# EAGLE board Dx32_V1.1 (EAGLE 9.6.2)
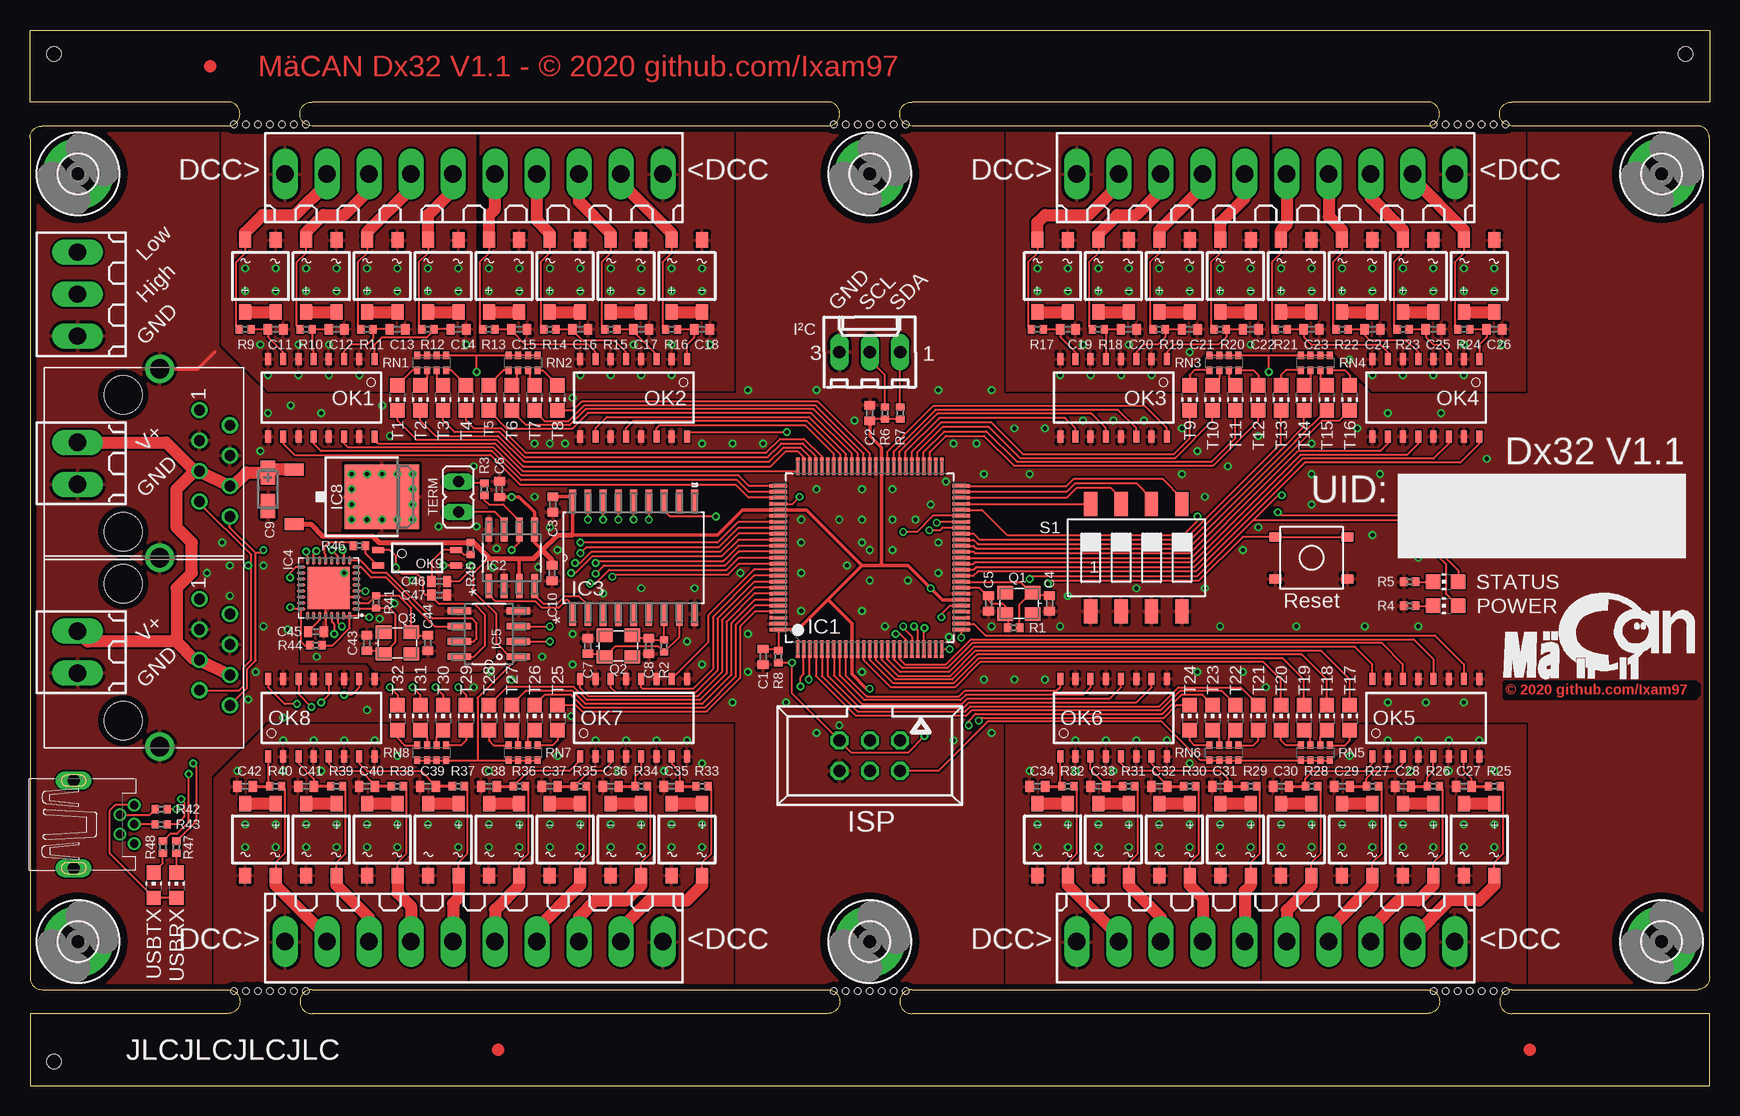
[diagram p2: board, top side]
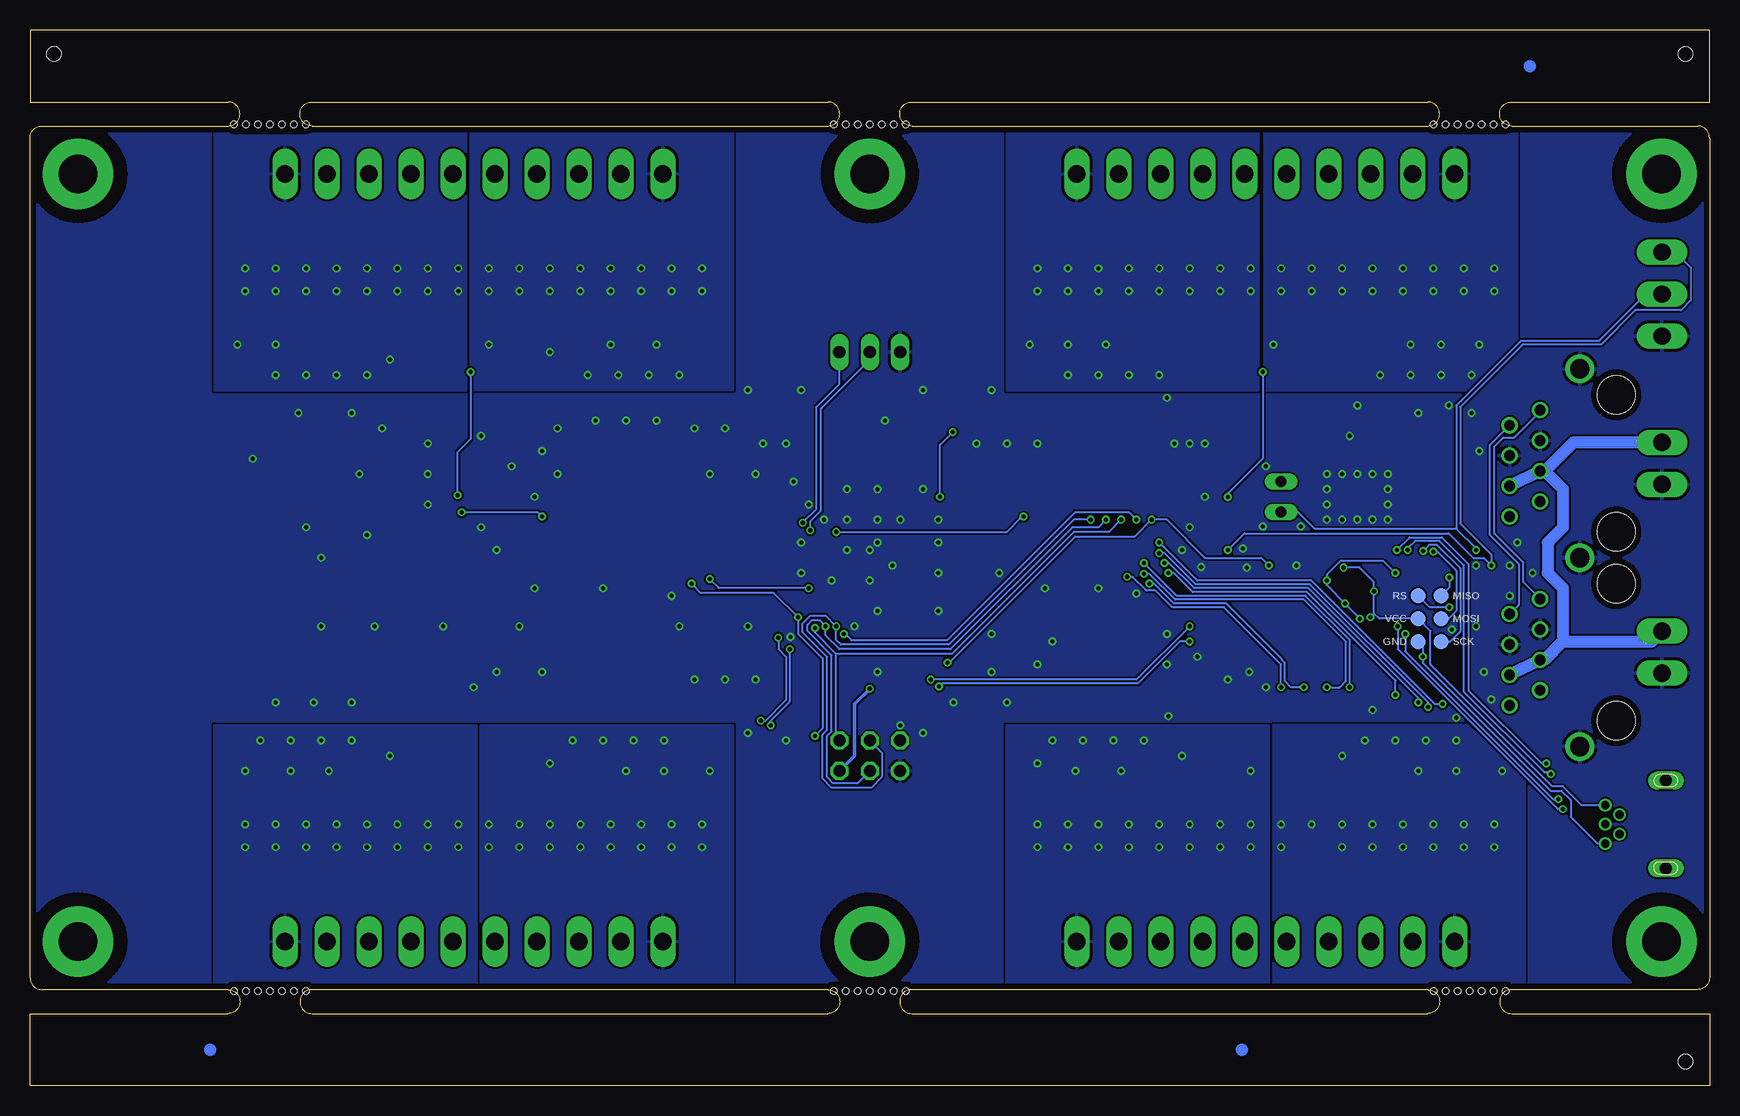
[diagram p3: board, bottom side, seen from below]

Size 140 x 88 mm. Coordinates in mm from the lower left corner, seen from the top.
Outline: 1,8 16.5,8 arc-90 17.5,7 arc-90 16.5,6 0,6 0,0 140,0 140,6 123.5,6 arc-90 122.5,7 arc-90 123.5,8 139,8 arc90 140,9 140,79 arc90 139,80 123.5,80 arc-90 122.5,81 arc-90 123.5,82 140,82 140,88 0,88 0,82 16.5,82 arc-90 17.5,81 arc-90 16.5,80 1,80 arc90 0,79 0,9 arc90 1,8
Outline: 23.5,8 66.5,8 arc-90 67.5,7 arc-90 66.5,6 23.5,6 arc-90 22.5,7 arc-90 23.5,8
Outline: 73.5,8 116.5,8 arc-90 117.5,7 arc-90 116.5,6 73.5,6 arc-90 72.5,7 arc-90 73.5,8
Outline: 116.5,80 73.5,80 arc-90 72.5,81 arc-90 73.5,82 116.5,82 arc-90 117.5,81 arc-90 116.5,80
Outline: 66.5,80 23.5,80 arc-90 22.5,81 arc-90 23.5,82 66.5,82 arc-90 67.5,81 arc-90 66.5,80
Copper layers (1*16): Top 0.035mm / dielectric 1.6mm / Bottom 0.035mm
Design rules "Elecrow_2-layer_PCB_eagle_rule": minimum track width 6mil, minimum drill 12mil, track to track 6mil, track to pad 6mil, pad to pad 6mil, via to via 8mil, smd to smd 0mil, copper to edge 20mil, drill to drill 10mil, minimum pad ring 6mil, minimum via ring 6mil, stop-mask expansion 0mil, vias tented up to drill 100mil, thermal gap 10mil

## Footprints (pad centres in the part's own frame; a part is rotated, then mirrored left to right if it is on the bottom)
MBS = smd 1 x 1.3: + -1.27,-3; - 1.27,-3; AC1 -1.27,3; AC2 1.27,3
C0402 = smd 0.7 x 0.9: 1 -0.65,0; 2 0.65,0
CT3216 = smd 2 x 1.2: + -1.4,0; - 1.4,0
B1,27 = smd 1.27 x 1.27: TP 0,0
3,2-PAD = drill 3.2 pad 5.842: B3,2 0,0
QFP50P1600X1600X120-100N = smd 1.473 x 0.279: 1 -7.62,5.994; 2 -7.62,5.512; 3 -7.62,5.004; 4 -7.62,4.496; 5 -7.62,3.988; 6 -7.62,3.505; 7 -7.62,2.997; 8 -7.62,2.489; 9 -7.62,2.007; 10 -7.62,1.499; 11 -7.62,0.991; 12 -7.62,0.508; 13 -7.62,0; 14 -7.62,-0.508; 15 -7.62,-0.991; 16 -7.62,-1.499; 17 -7.62,-2.007; 18 -7.62,-2.489; 19 -7.62,-2.997; 20 -7.62,-3.505; 21 -7.62,-3.988; 22 -7.62,-4.496; 23 -7.62,-5.004; 24 -7.62,-5.512; 25 -7.62,-5.994; 51 7.62,-5.994; 52 7.62,-5.512; 53 7.62,-5.004; 54 7.62,-4.496; 55 7.62,-3.988; 56 7.62,-3.505; 57 7.62,-2.997; 58 7.62,-2.489; 59 7.62,-2.007; 60 7.62,-1.499; 61 7.62,-0.991; 62 7.62,-0.508; 63 7.62,0; 64 7.62,0.508; 65 7.62,0.991; 66 7.62,1.499; 67 7.62,2.007; 68 7.62,2.489; 69 7.62,2.997; 70 7.62,3.505; 71 7.62,3.988; 72 7.62,4.496; 73 7.62,5.004; 74 7.62,5.512; 75 7.62,5.994 | smd 0.279 x 1.473: 26 -5.994,-7.62; 27 -5.512,-7.62; 28 -5.004,-7.62; 29 -4.496,-7.62; 30 -3.988,-7.62; 31 -3.505,-7.62; 32 -2.997,-7.62; 33 -2.489,-7.62; 34 -2.007,-7.62; 35 -1.499,-7.62; 36 -0.991,-7.62; 37 -0.508,-7.62; 38 0,-7.62; 39 0.508,-7.62; 40 0.991,-7.62; 41 1.499,-7.62; 42 2.007,-7.62; 43 2.489,-7.62; 44 2.997,-7.62; 45 3.505,-7.62; 46 3.988,-7.62; 47 4.496,-7.62; 48 5.004,-7.62; 49 5.512,-7.62; 50 5.994,-7.62; 76 5.994,7.62; 77 5.512,7.62; 78 5.004,7.62; 79 4.496,7.62; 80 3.988,7.62; 81 3.505,7.62; 82 2.997,7.62; 83 2.489,7.62; 84 2.007,7.62; 85 1.499,7.62; 86 0.991,7.62; 87 0.508,7.62; 88 0,7.62; 89 -0.508,7.62; 90 -0.991,7.62; 91 -1.499,7.62; 92 -2.007,7.62; 93 -2.489,7.62; 94 -2.997,7.62; 95 -3.505,7.62; 96 -3.988,7.62; 97 -4.496,7.62; 98 -5.004,7.62; 99 -5.512,7.62; 100 -5.994,7.62
SOIC127P600X175-8N = smd 1.981 x 0.559: 1 -2.362,1.905; 2 -2.362,0.635; 3 -2.362,-0.635; 4 -2.362,-1.905; 5 2.362,-1.905; 6 2.362,-0.635; 7 2.362,0.635; 8 2.362,1.905
SOIC127P1034X264-18N = smd 1.981 x 0.559: 1 -4.699,5.08; 2 -4.699,3.81; 3 -4.699,2.54; 4 -4.699,1.27; 5 -4.699,0; 6 -4.699,-1.27; 7 -4.699,-2.54; 8 -4.699,-3.81; 9 -4.699,-5.08; 10 4.699,-5.08; 11 4.699,-3.81; 12 4.699,-2.54; 13 4.699,-1.27; 14 4.699,0; 15 4.699,1.27; 16 4.699,2.54; 17 4.699,3.81; 18 4.699,5.08
QFN50P500X500X100-33N = smd 0.7 x 0.3: 1 -2.3,1.75; 2 -2.3,1.25; 3 -2.3,0.75; 4 -2.3,0.25; 5 -2.3,-0.25; 6 -2.3,-0.75; 7 -2.3,-1.25; 8 -2.3,-1.75; 17 2.3,-1.75; 18 2.3,-1.25; 19 2.3,-0.75; 20 2.3,-0.25; 21 2.3,0.25; 22 2.3,0.75; 23 2.3,1.25; 24 2.3,1.75 | smd 0.3 x 0.7: 9 -1.75,-2.3; 10 -1.25,-2.3; 11 -0.75,-2.3; 12 -0.25,-2.3; 13 0.25,-2.3; 14 0.75,-2.3; 15 1.25,-2.3; 16 1.75,-2.3; 25 1.75,2.3; 26 1.25,2.3; 27 0.75,2.3; 28 0.25,2.3; 29 -0.25,2.3; 30 -0.75,2.3; 31 -1.25,2.3; 32 -1.75,2.3 | smd 3.5 x 3.5: 33 0,0
SOIC127P600X175-8N' = smd 1.981 x 0.559: 1 -2.464,1.905; 2 -2.464,0.635; 3 -2.464,-0.635; 4 -2.464,-1.905; 5 2.464,-1.905; 6 2.464,-0.635; 7 2.464,0.635; 8 2.464,1.905
TO252 = smd 1 x 1.6: 1 -2.28,-4.8; 2 2.28,-4.8 | smd 5.4 x 6.2: 3 0,2.5
057-006-1 = drill 1 octagon: 1 -2.54,-1.27; 2 -2.54,1.27; 3 0,-1.27; 4 0,1.27; 5 2.54,-1.27; 6 2.54,1.27
6410-03 = drill 1.016 long: 1 2.54,0; 2 0,0; 3 -2.54,0
615008140421 = drill 0.9: 1 -4.445,-1.27; 2 -3.175,1.27; 3 -1.905,-1.27; 4 -0.635,1.27; 5 0.635,-1.27; 6 1.905,1.27; 7 3.175,-1.27; 8 4.445,1.27 | drill 1.6: SHELL -7.875,-4.57; SHELL1 7.875,-4.57 | hole 3.17: -5.715,-7.62; 5.715,-7.62
MINI-FLAT-16 = smd 1 x 0.5: 1 -3.24,4.445; 2 -3.24,3.175; 3 -3.24,1.905; 4 -3.24,0.635; 5 -3.24,-0.635; 6 -3.24,-1.905; 7 -3.24,-3.175; 8 -3.24,-4.445; 9 3.24,-4.445; 10 3.24,-3.175; 11 3.24,-1.905; 12 3.24,-0.635; 13 3.24,0.635; 14 3.24,1.905; 15 3.24,3.175; 16 3.24,4.445
MINI-FLAT-4 = smd 1 x 0.5: 1 -3.24,0.635; 2 -3.24,-0.635; 3 3.24,-0.635; 4 3.24,0.635
CHIP-LED0805 = smd 1.2 x 1.2: A 0,-1.05; C 0,1.05
3.2X2.5_KX-7 = smd 1.3 x 1.1: 1 -1.15,-0.9; 2 1.15,-0.9; 3 1.15,0.9; 4 -1.15,0.9
R0402 = smd 0.6 x 0.7: 1 -0.5,0; 2 0.5,0
0603-ARV = smd 0.5 x 0.65: 1 -1.2,-0.625; 2 -0.4,-0.625; 3 0.4,-0.625; 4 1.2,-0.625; 5 1.2,0.625; 6 0.4,0.625; 7 -0.4,0.625; 8 -1.2,0.625
SMS-004 = smd 1.092 x 2.007: 1 -3.81,-4.496; 2 -1.27,-4.496; 3 1.27,-4.496; 4 3.81,-4.496; 5 3.81,4.496; 6 1.27,4.496; 7 -1.27,4.496; 8 -3.81,4.496
JP1 = drill 0.914 long: 1 0,-1.27; 2 0,1.27
JLCPCB_TOOLINGHOLE = hole 1.152: 0,0
MOUSEBITESX7 = hole 0.5: 0,0; -1,0; -2,0; 1,0; 2,0; 3,0; -3,0
BUTTON = smd 1 x 0.75: P$1 -3,1.75; P$2 3,1.75; P$3 3,-1.75; P$4 -3,-1.75
180-10 = drill 1.422 long: 1 -15.75,0; 2 -12.25,0; 3 -8.75,0; 4 -5.25,0; 5 -1.75,0; 6 1.75,0; 7 5.25,0; 8 8.75,0; 9 12.25,0; 10 15.75,0
180-2 = drill 1.422 long: 1 -1.75,0; 2 1.75,0
32005-601 = drill 0.7 pad 1.016: 1 2.825,1.6; 2 1.625,0.8; 3 2.825,0; 4 1.625,-0.8; 5 2.825,-1.6 | drill 1 pad 1.422 long: M1 -2.225,3.65; M2 -2.225,-3.65
180-3 = drill 1.422 long: 1 -3.5,0; 2 0,0; 3 3.5,0

## Placement (x,y rotation side)
B1  KMB24F  [MBS]  19.2,67.5 0 top
B2  KMB24F  [MBS]  24.28,67.5 0 top
B3  KMB24F  [MBS]  29.36,67.5 0 top
B4  KMB24F  [MBS]  34.44,67.5 0 top
B5  KMB24F  [MBS]  39.52,67.5 0 top
B6  KMB24F  [MBS]  44.6,67.5 0 top
B7  KMB24F  [MBS]  49.68,67.5 0 top
B8  KMB24F  [MBS]  54.76,67.5 0 top
B9  KMB24F  [MBS]  85.24,67.5 0 top
B10  KMB24F  [MBS]  90.32,67.5 0 top
B11  KMB24F  [MBS]  95.4,67.5 0 top
B12  KMB24F  [MBS]  100.48,67.5 0 top
B13  KMB24F  [MBS]  105.56,67.5 0 top
B14  KMB24F  [MBS]  110.64,67.5 0 top
B15  KMB24F  [MBS]  115.72,67.5 0 top
B16  KMB24F  [MBS]  120.8,67.5 0 top
B17  KMB24F  [MBS]  120.8,20.5 180 top
B18  KMB24F  [MBS]  115.72,20.5 180 top
B19  KMB24F  [MBS]  110.64,20.5 180 top
B20  KMB24F  [MBS]  105.56,20.5 180 top
B21  KMB24F  [MBS]  100.48,20.5 180 top
B22  KMB24F  [MBS]  95.4,20.5 180 top
B23  KMB24F  [MBS]  90.32,20.5 180 top
B24  KMB24F  [MBS]  85.24,20.5 180 top
B25  KMB24F  [MBS]  54.76,20.5 180 top
B26  KMB24F  [MBS]  49.68,20.5 180 top
B27  KMB24F  [MBS]  44.6,20.5 180 top
B28  KMB24F  [MBS]  39.52,20.5 180 top
B29  KMB24F  [MBS]  34.44,20.5 180 top
B30  KMB24F  [MBS]  29.36,20.5 180 top
B31  KMB24F  [MBS]  24.28,20.5 180 top
B32  KMB24F  [MBS]  19.2,20.5 180 top
C1  100n  [C0402]  61.11,35.74 270 top
C2  100n  [C0402]  70,56.06 90 top
C3  100n  [C0402]  43.58,48.45 270 top
C4  22p  [C0402]  84.99,40.19 270 top
C5  22p  [C0402]  79.91,40.19 270 top
C6  100n  [C0402]  39.14,49.72 90 top
C7  22p  [C0402]  46.5,36.63 90 top
C8  22p  [C0402]  51.59,36.63 270 top
C9  [CT3216]  19.84,49.72 270 top
C10  100n  [C0402]  43.52,42.73 270 top
C11  100n  [C0402]  20.47,63.05 0 top
C12  100n  [C0402]  25.55,63.05 0 top
C13  100n  [C0402]  30.63,63.05 0 top
C14  100n  [C0402]  35.71,63.05 0 top
C15  100n  [C0402]  40.79,63.05 0 top
C16  100n  [C0402]  45.87,63.05 0 top
C17  100n  [C0402]  50.95,63.05 0 top
C18  100n  [C0402]  56.03,63.05 0 top
C19  100n  [C0402]  86.51,63.05 0 top
C20  100n  [C0402]  91.59,63.05 0 top
C21  100n  [C0402]  96.67,63.05 0 top
C22  100n  [C0402]  101.75,63.05 0 top
C23  100n  [C0402]  106.83,63.05 0 top
C24  100n  [C0402]  111.91,63.05 0 top
C25  100n  [C0402]  116.99,63.05 0 top
C26  100n  [C0402]  122.07,63.05 0 top
C27  100n  [C0402]  119.53,24.95 180 top
C28  100n  [C0402]  114.45,24.95 180 top
C29  100n  [C0402]  109.37,24.95 180 top
C30  100n  [C0402]  104.29,24.95 180 top
C31  100n  [C0402]  99.21,24.95 180 top
C32  100n  [C0402]  94.13,24.95 180 top
C33  100n  [C0402]  89.05,24.95 180 top
C34  100n  [C0402]  83.97,24.95 180 top
C35  100n  [C0402]  53.49,24.95 180 top
C36  100n  [C0402]  48.41,24.95 180 top
C37  100n  [C0402]  43.33,24.95 180 top
C38  100n  [C0402]  38.25,24.95 180 top
C39  100n  [C0402]  33.17,24.95 180 top
C40  100n  [C0402]  28.09,24.95 180 top
C41  100n  [C0402]  23.01,24.95 180 top
C42  100n  [C0402]  17.93,24.95 180 top
C43  22p  [C0402]  28.09,36.89 90 top
C44  22p  [C0402]  33.17,36.89 270 top
C45  1u  [C0402]  23.84,37.84 0 top
C46  100n  [C0402]  34.12,42.03 0 top
C47  100n  [C0402]  34.12,40.89 0 top
GND  TPB1,27  [B1,27]  24.28,37.02 0 bottom
H1  MOUNT-PAD-ROUND3.2  [3,2-PAD]  4,76 0 top
H2  MOUNT-PAD-ROUND3.2  [3,2-PAD]  70,76 0 top
H3  MOUNT-PAD-ROUND3.2  [3,2-PAD]  136,76 0 top
H4  MOUNT-PAD-ROUND3.2  [3,2-PAD]  4,12 0 top
H5  MOUNT-PAD-ROUND3.2  [3,2-PAD]  70,12 0 top
H6  MOUNT-PAD-ROUND3.2  [3,2-PAD]  136,12 0 top
IC1  ATMEGA2560-16AU  [QFP50P1600X1600X120-100N]  70,44 90 top
IC2  MCP2551-I/SN  [SOIC127P600X175-8N]  40.16,44 90 top
IC3  MCP2515-I/SO  [SOIC127P1034X264-18N]  50.31,44 90 top
IC4  ATMEGA16U2-MU  [QFN50P500X500X100-33N]  24.91,41.46 180 top
IC5  ADUM1201ARZ-RL7  [SOIC127P600X175-8N']  38.25,37.65 180 top
IC8  L78M05  [TO252]  26.82,49.08 270 top
ISP  057-006-1  [057-006-1]  70,27.49 180 top
I²C  22-27-2031-03  [6410-03]  70,61.14 0 top
J1  [615008140421]  15.39,36.13 270 top
J2  [615008140421]  15.39,51.87 270 top
MISO  TPB1,27  [B1,27]  22.38,40.83 180 bottom
MOSI  TPB1,27  [B1,27]  22.38,38.92 180 bottom
OK1  TLP290-4  [MINI-FLAT-16]  24.28,57.34 270 top
OK2  TLP290-4  [MINI-FLAT-16]  50.31,57.34 270 top
OK3  TLP290-4  [MINI-FLAT-16]  90.32,57.34 270 top
OK4  TLP290-4  [MINI-FLAT-16]  116.35,57.34 270 top
OK5  TLP290-4  [MINI-FLAT-16]  116.35,30.66 90 top
OK6  TLP290-4  [MINI-FLAT-16]  90.32,30.66 90 top
OK7  TLP290-4  [MINI-FLAT-16]  50.31,30.66 90 top
OK8  TLP290-4  [MINI-FLAT-16]  24.28,30.66 90 top
OK9  TLP290  [MINI-FLAT-4]  32.28,44 0 top
POWER  red  [CHIP-LED0805]  118,40 90 top
Q1  16MHZ  [3.2X2.5_KX-7]  82.45,40.19 180 top
Q2  16MHZ  [3.2X2.5_KX-7]  49.05,36.63 0 top
Q3  16MHZ  [3.2X2.5_KX-7]  30.63,36.89 0 top
R1  1M  [R0402]  82,38.16 180 top
R2  1M  [R0402]  52.86,36.63 90 top
R3  120  [R0402]  37.87,49.72 90 top
R4  1k  [R0402]  115,40 180 top
R5  1k  [R0402]  115,42 180 top
R6  10k  [R0402]  71.27,56.06 270 top
R7  10k  [R0402]  72.54,56.06 270 top
R8  10k  [R0402]  62.38,35.74 90 top
R9  33  [R0402]  17.93,63.05 180 top
R10  33  [R0402]  23.01,63.05 180 top
R11  33  [R0402]  28.09,63.05 180 top
R12  33  [R0402]  33.17,63.05 180 top
R13  33  [R0402]  38.25,63.05 180 top
R14  33  [R0402]  43.33,63.05 180 top
R15  33  [R0402]  48.41,63.05 180 top
R16  33  [R0402]  53.49,63.05 180 top
R17  33  [R0402]  83.97,63.05 180 top
R18  33  [R0402]  89.05,63.05 180 top
R19  33  [R0402]  94.13,63.05 180 top
R20  33  [R0402]  99.21,63.05 180 top
R21  33  [R0402]  104.29,63.05 180 top
R22  33  [R0402]  109.37,63.05 180 top
R23  33  [R0402]  114.45,63.05 180 top
R24  33  [R0402]  119.53,63.05 180 top
R25  33  [R0402]  122.07,24.95 0 top
R26  33  [R0402]  116.99,24.95 0 top
R27  33  [R0402]  111.91,24.95 0 top
R28  33  [R0402]  106.83,24.95 0 top
R29  33  [R0402]  101.75,24.95 0 top
R30  33  [R0402]  96.67,24.95 0 top
R31  33  [R0402]  91.59,24.95 0 top
R32  33  [R0402]  86.51,24.95 0 top
R33  33  [R0402]  56.03,24.95 0 top
R34  33  [R0402]  50.95,24.95 0 top
R35  33  [R0402]  45.87,24.95 0 top
R36  33  [R0402]  40.79,24.95 0 top
R37  33  [R0402]  35.71,24.95 0 top
R38  33  [R0402]  30.63,24.95 0 top
R39  33  [R0402]  25.55,24.95 0 top
R40  33  [R0402]  20.47,24.95 0 top
R41  1M  [R0402]  28.85,40.32 90 top
R42  22  [R0402]  10.95,23.05 180 top
R43  22  [R0402]  10.95,21.77 180 top
R44  10k  [R0402]  23.84,36.7 180 top
R45  10k  [R0402]  36.73,44.76 90 top
R46  330  [R0402]  27.45,45.02 180 top
R47  1k  [R0402]  12.22,19.87 90 top
R48  1k  [R0402]  11.07,19.87 90 top
RN1  [0603-ARV]  33.49,60.26 0 top
RN2  [0603-ARV]  41.11,60.26 0 top
RN3  [0603-ARV]  99.53,60.26 0 top
RN4  [0603-ARV]  107.15,60.26 0 top
RN5  [0603-ARV]  107.15,27.74 180 top
RN6  [0603-ARV]  99.53,27.74 180 top
RN7  [0603-ARV]  41.11,27.74 180 top
RN8  [0603-ARV]  33.49,27.74 180 top
RS  TPB1,27  [B1,27]  24.28,40.83 270 bottom
S1  SWS004  [SMS-004]  92.22,44 0 top
SCK  TPB1,27  [B1,27]  22.38,37.02 180 bottom
STATUS  green  [CHIP-LED0805]  118,42 90 top
T1  red  [CHIP-LED0805]  30.63,57.34 180 top
T2  red  [CHIP-LED0805]  32.53,57.34 180 top
T3  red  [CHIP-LED0805]  34.44,57.34 180 top
T4  red  [CHIP-LED0805]  36.34,57.34 180 top
T5  red  [CHIP-LED0805]  38.25,57.34 180 top
T6  red  [CHIP-LED0805]  40.16,57.34 180 top
T7  red  [CHIP-LED0805]  42.06,57.34 180 top
T8  red  [CHIP-LED0805]  43.97,57.34 180 top
T9  red  [CHIP-LED0805]  96.67,57.34 180 top
T10  red  [CHIP-LED0805]  98.58,57.34 180 top
T11  red  [CHIP-LED0805]  100.48,57.34 180 top
T12  red  [CHIP-LED0805]  102.38,57.34 180 top
T13  red  [CHIP-LED0805]  104.29,57.34 180 top
T14  red  [CHIP-LED0805]  106.19,57.34 180 top
T15  red  [CHIP-LED0805]  108.1,57.34 180 top
T16  red  [CHIP-LED0805]  110,57.34 180 top
T17  red  [CHIP-LED0805]  110,30.66 0 top
T18  red  [CHIP-LED0805]  108.1,30.66 0 top
T19  red  [CHIP-LED0805]  106.19,30.66 0 top
T20  red  [CHIP-LED0805]  104.29,30.66 0 top
T21  red  [CHIP-LED0805]  102.38,30.66 0 top
T22  red  [CHIP-LED0805]  100.48,30.66 0 top
T23  red  [CHIP-LED0805]  98.58,30.66 0 top
T24  red  [CHIP-LED0805]  96.67,30.66 0 top
T25  red  [CHIP-LED0805]  43.97,30.66 0 top
T26  red  [CHIP-LED0805]  42.06,30.66 0 top
T27  red  [CHIP-LED0805]  40.16,30.66 0 top
T28  red  [CHIP-LED0805]  38.25,30.66 0 top
T29  red  [CHIP-LED0805]  36.34,30.66 0 top
T30  red  [CHIP-LED0805]  34.44,30.66 0 top
T31  red  [CHIP-LED0805]  32.53,30.66 0 top
T32  red  [CHIP-LED0805]  30.63,30.66 0 top
TERM  [JP1]  35.71,49.08 180 top
U$2  [JLCPCB_TOOLINGHOLE]  2,86 0 top
U$3  [JLCPCB_TOOLINGHOLE]  2,2 0 top
U$5  [JLCPCB_TOOLINGHOLE]  138,86 0 top
U$6  [FIDUCIAL]  15,85 90 top
U$7  [FIDUCIAL]  125,3 90 top
U$8  [FIDUCIAL]  39,3 90 top
U$9  [MOUSEBITESX7]  70,7.88 0 top
U$10  [MOUSEBITESX7]  120,7.88 0 top
U$11  [MOUSEBITESX7]  20,7.88 0 top
U$12  [MOUSEBITESX7]  20,80.12 0 top
U$13  [MOUSEBITESX7]  70,80.12 0 top
U$14  [MOUSEBITESX7]  120,80.12 0 top
U$15  BUTTON_JLC  [BUTTON]  106.83,44 180 top
U$17  [LOGO_2]  122.7,32.57 0 top
USBRX  yellow  [CHIP-LED0805]  12.22,16.7 0 top
USBTX  yellow  [CHIP-LED0805]  10.31,16.7 0 top
VCC  TPB1,27  [B1,27]  24.28,38.92 0 bottom
X1  [180-10]  37,76 0 top
X2  [180-10]  103,76 0 top
X3  [180-10]  103,12 180 top
X4  [180-10]  37,12 180 top
X5  [180-2]  3.96,51.87 90 top
X6  MINI-USB_SHIELD5P2-32005-601  [32005-601]  5.86,21.77 0 top
X7  [180-2]  3.96,36.13 90 top
X17  [180-3]  3.96,65.97 90 top

## Tracks (layer width: path | path; a pad name or v marks a point on that pad's centre or on a via)
A0
  Top 0.152: IC1.78 59.92,49 58.82,50.1 40.85,50.1 38.38,52.57 22.06,52.57 21.1,53.52 OK1.10
A1
  Top 0.152: IC1.77 62.37,49.5 59.93,49.5 58.95,50.48 40.92,50.48 38.5,52.89 24.28,52.89 23.65,53.52 OK1.12
A2
  Top 0.152: IC1.76 59.94,49.99 59.08,50.86 40.98,50.86 38.63,53.21 26.5,53.21 26.19,53.52 OK1.14
A3
  Top 0.152: OK1.16 28.73,53.84 29.04,53.52 38.76,53.52 41.04,51.24 64.01,51.24 IC1.75
A4
  Top 0.152: IC1.74 64.49,52.38 63.98,52.89 63.02,52.89 61.74,51.62 41.11,51.62 38.89,53.84 32.22,53.84 30.63,55.43 T1.C
A5
  Top 0.152: IC1.73 65,52.43 64.22,53.21 62.82,53.21 61.62,52 41.17,52 39.01,54.16 33.8,54.16 32.53,55.43 T2.C
A6
  Top 0.152: IC1.72 65.5,52.43 64.41,53.52 62.63,53.52 61.49,52.38 41.23,52.38 39.14,54.48 35.39,54.48 34.44,55.43 T3.C
A7
  Top 0.152: IC1.71 66.01,52.43 64.54,53.91 62.51,53.91 61.36,52.76 41.3,52.76 39.27,54.8 36.98,54.8 36.34,55.43 T4.C
C0
  Top 0.152: IC1.53 75,52.81 76.35,54.16 79.53,54.16 82,51.68 98.64,51.68 102.38,55.43 T12.C
C1
  Top 0.152: IC1.54 74.5,52.81 76.22,54.54 79.72,54.54 82.25,52 98.51,52 100.48,53.97 T11.C
C2
  Top 0.152: IC1.55 73.99,52.81 76.1,54.92 79.91,54.92 82.51,52.32 95.46,52.32 98.58,55.43 T10.C
C3
  Top 0.152: IC1.56 73.5,52.84 75.97,55.3 80.1,55.3 82.76,52.64 95.34,52.64 96.67,53.97 T9.C
C4
  Top 0.152: IC1.57 73,52.84 75.81,55.65 86.29,55.65 87.14,54.8 OK3.10
C5
  Top 0.152: IC1.58 72.49,52.84 75.65,56 88.48,56 89.69,54.8 OK3.12
C6
  Top 0.152: IC1.59 72.01,52.87 75.46,56.32 90.7,56.32 92.22,54.8 OK3.14
C7
  Top 0.152: IC1.60 71.5,52.87 75.27,56.64 92.92,56.64 94.77,54.8 OK3.16
CAN_H  (via drill 0.35)
  Top 0.152: IC2.7 39.52,47.05 38.76,47.81 TERM.2 | 18.82,44.38 18.82,35.43 18.11,34.72 18.11,33.13 J1.8 | v19.45,44.63 19.2,44.38 18.82,44.38 | 18.82,44.38 16.66,46.54 J2.8
  Bottom 0.152: 21.1,46.41 19.45,44.76 v19.45,44.63 | 21.1,46.41 32.92,46.41 34.31,47.81 TERM.2 | X17.2 5.29,65.97 9.17,62.1 15.71,62.1 21.1,56.7 21.1,46.41
CAN_L  (via drill 0.35)
  Top 0.152: 18.44,43.37 18.44,35.49 17.8,34.86 17.8,33.33 17.42,32.95 J1.7 | 18.44,43.37 18.44,44.25 14.12,48.57 J2.7 | v18.18,43.37 18.44,43.37 | v40.16,44.63 40.79,45.27 IC2.6 40.79,47.11 39.46,48.45 38.25,48.45 37.87,48.83 R3.1
  Bottom 0.152: v40.16,44.63 38.76,46.03 21.74,46.03 19.71,44 18.82,44 v18.18,43.37 18.18,44.25 20.79,46.86 20.79,56.57 15.58,61.78 9.04,61.78 6.18,64.64 2.37,64.64 1.55,65.46 1.55,68.19 2.83,69.47 X17.3
CAN_V+
  Top 1.016: J1.6 J1.5 13.74,35.49 12.22,37.02 | 13.74,51.24 12.22,49.72 12.22,46.54 13.48,45.27 13.48,42.73 12.22,41.46 12.22,37.02 | 13.74,51.24 J2.5 J2.6 16.91,49.97 18.06,51.12 C9.+ 20.08,51.36 IC8.1 | X5.2 11.35,53.62 13.74,51.24 | X7.2 4.82,37.02 12.22,37.02
  Bottom 1.016: J1.6 J1.5 13.74,35.49 12.22,37.02 | J2.6 J2.5 13.74,51.24 | 13.74,51.24 12.22,49.72 12.22,46.54 13.48,45.27 13.48,42.73 12.22,41.46 12.22,37.02 | X7.2 4.82,37.02 12.22,37.02 | X5.2 11.35,53.62 13.74,51.24
CS  (via drill 0.35)
  Top 0.152: v47.77,47.17 IC3.16 | IC1.19 73,37.19 72.54,37.65 v72.16,37.65
  Bottom 0.152: v47.77,47.17 48.41,47.81 52.86,47.81 63.52,37.14 71.52,37.14 72.03,37.65 v72.16,37.65
D+  (via drill 0.35)
  Top 0.152: IC4.29 25.16,38.65 25.35,38.46 v25.35,37.65 v25.36,37.65 | v12.6,23.87 12.85,23.62 12.85,22.41 12.22,21.77 R43.1
  Bottom 0.152: v25.36,37.65 25.36,36.19 13.04,23.87 v12.6,23.87
D-  (via drill 0.35)
  Top 0.152: IC4.30 25.66,38.61 v25.99,38.28 | R42.1 v12.22,23.05
  Bottom 0.152: v25.99,38.28 25.99,36.38 12.66,23.05 v12.22,23.05
DCC1  (via drill 0.35)
  other vias: 17.93,68.13 17.93,66.22 20.47,66.22 20.47,68.13 23.01,68.13 25.55,68.13 28.09,68.13 30.63,68.13 33.17,68.13 35.71,68.13 35.71,66.22 33.17,66.22 30.63,66.22 28.09,66.22 25.55,66.22 23.01,66.22 22.38,61.78 24.91,61.78 19.2,61.78 27.45,59.24 24.91,59.24 22.38,59.24 19.84,59.24 36.34,61.78
  pour Bottom (rank 2): 16.02,79.56 37.11,79.56 37.11,57.97 19.84,57.97 16.02,61.78
  pour Top: 16.02,79.56 16.02,61.78 19.84,57.97 30.63,57.97 31.9,59.24 31.9,60.51 32.53,61.14 37.11,61.14 37.11,79.56
DCC2  (via drill 0.35)
  other vias: 38.25,68.13 40.79,68.13 40.79,66.22 38.25,66.22 43.33,66.22 45.87,66.22 45.87,68.13 43.33,68.13 48.41,68.13 50.95,68.13 50.95,66.22 48.41,66.22 53.49,66.22 53.49,68.13 56.03,68.13 56.03,66.22 45.87,59.24 48.41,59.24 50.95,59.24 53.49,59.24 53.49,61.78 50.31,61.78 56.66,61.78
  pour Bottom (rank 2): 58.57,79.56 58.57,57.97 37.62,57.97 37.62,79.56
  pour Top: 58.57,79.56 58.57,57.97 44.6,57.97 42.7,59.88 42.7,61.14 37.62,61.14 37.62,79.56
DCC3  (via drill 0.35)
  other vias: 83.97,68.13 86.51,68.13 86.51,66.22 83.97,66.22 89.05,68.13 91.59,68.13 94.13,68.13 96.67,68.13 99.21,68.13 89.05,66.22 91.59,66.22 94.13,66.22 96.67,66.22 99.21,66.22 101.75,68.13 101.75,66.22 101.75,61.78 91.59,61.78 87.78,61.78 85.88,59.24 88.41,59.24 90.95,59.24 93.5,59.24 96.67,61.14
  pour Top: 81.43,80.19 81.43,57.97 96.03,57.97 96.03,59.24 97.94,61.14 103.21,61.14 103.21,80.19
  pour Bottom: 81.43,80.83 81.43,57.97 103.21,57.97 103.21,80.83
DCC4  (via drill 0.35)
  other vias: 104.29,68.13 106.83,68.13 109.37,68.13 111.91,68.13 114.45,68.13 116.99,68.13 119.53,68.13 122.07,68.13 122.07,66.22 119.53,66.22 116.99,66.22 114.45,66.22 111.91,66.22 109.37,66.22 106.83,66.22 104.29,66.22 110,60.51 111.91,59.24 114.45,59.24 116.99,59.24 119.53,59.24 119.53,61.78 122.7,61.78
  pour Top: 103.66,80.19 103.66,61.14 108.73,61.14 111.91,57.97 124.61,57.97 124.61,80.19
  pour Bottom: 103.66,80.19 124.61,80.19 124.61,57.97 103.66,57.97
DCC5  (via drill 0.35)
  other vias: 104.29,19.87 104.29,21.77 106.83,21.77 106.83,19.87 109.37,19.87 111.91,19.87 114.45,19.87 116.99,19.87 116.99,21.77 114.45,21.77 111.91,21.77 109.37,21.77 119.53,21.77 119.53,19.87 122.07,19.87 122.07,21.77 115.09,26.22 118.26,26.22 122.07,26.22 110,27.49 113.18,28.76 115.72,28.76 118.26,28.76 120.8,28.76
  pour Bottom: 124.61,7.8 124.61,30.03 102.83,30.03 102.83,7.8
  pour Top: 124.61,7.8 102.83,7.8 102.83,26.86 108.73,26.86 110.64,28.76 110.64,30.03 124.61,30.03
DCC6  (via drill 0.35)
  other vias: 101.75,19.87 99.21,19.87 99.21,21.77 101.75,21.77 96.67,21.77 94.13,21.77 94.13,19.87 96.67,19.87 91.59,21.77 89.05,21.77 86.51,21.77 83.97,21.77 83.97,19.87 86.51,19.87 89.05,19.87 91.59,19.87 94.77,28.76 92.22,28.76 89.69,28.76 87.14,28.76 83.34,26.22 87.14,26.22 90.32,26.22 96.67,26.86
  pour Bottom: 81.43,7.8 102.38,7.8 102.38,30.03 81.43,30.03
  pour Top: 81.43,7.8 81.43,30.03 94.13,30.03 97.31,26.86 102.38,26.86 102.38,7.8
DCC7  (via drill 0.35)
  other vias: 38.25,19.87 38.25,21.77 40.79,21.77 43.33,21.77 45.87,21.77 48.41,21.77 50.95,21.77 53.49,21.77 56.03,21.77 56.03,19.87 53.49,19.87 50.95,19.87 48.41,19.87 45.87,19.87 43.33,19.87 40.79,19.87 38.25,26.22 43.97,27.49 49.05,26.22 52.86,26.22 56.03,26.86 47.14,28.76 49.68,28.76 52.22,28.76 54.76,28.76
  pour Top: 58.57,7.8 58.57,30.03 44.6,30.03 44.6,28.76 42.7,26.86 36.79,26.86 36.79,7.8
  pour Bottom: 58.57,7.8 58.57,30.03 44.6,30.03 36.79,30.03 36.79,7.8
DCC8  (via drill 0.35)
  Top 0.152: 32.52,25.09 C39.2
  other vias: 35.71,19.87 35.71,21.77 33.17,21.77 30.63,21.77 28.09,21.77 25.55,21.77 23.01,21.77 20.47,21.77 17.93,21.77 17.93,19.87 20.47,19.87 23.01,19.87 25.55,19.87 28.09,19.87 30.63,19.87 21.1,26.22 24.28,26.22 30.63,27.49 28.73,28.76 26.19,28.76 23.65,28.76 21.1,28.76 17.3,26.22
  pour Top: 15.39,7.17 36.34,7.17 36.34,24.95 33.8,24.95 31.9,26.86 31.9,28.12 29.99,30.03 19.84,30.03 15.39,25.59
  pour Bottom: 15.39,7.8 15.39,25.59 19.84,30.03 36.34,30.03 36.34,7.8
DTR
  Top 0.152: IC4.13 24.66,44.27 24.54,44.4 24.54,44.89 24.91,45.27 26.7,45.27 R46.2
E0  (via drill 0.35)
  Top 0.152: IC1.26 v77.62,37.33 | v79.08,30.41 79.34,30.66 94.51,30.66 95.56,31.71 T24.C
  Bottom 0.152: v77.62,37.33 77.62,36.38 76.98,35.74 76.98,32.13 78.7,30.41 v79.08,30.41
E1  (via drill 0.35)
  Top 0.152: IC1.25 v76.67,36.38 | T23.C 98.58,31.74 97.75,32.57 95.97,32.57 94.38,30.98 78.83,30.98 78.25,30.41 v78.25,30.03
  Bottom 0.152: v76.67,36.38 76.67,32 78.25,30.41 v78.25,30.03
E2
  Top 0.152: IC1.4 65.5,34.14 68.79,30.86 78.06,30.86 78.51,31.3 94.26,31.3 95.84,32.89 99.34,32.89 100.48,31.74 T22.C
E3
  Top 0.152: IC1.5 66.01,34.14 68.98,31.17 77.94,31.17 78.38,31.62 94.13,31.62 95.72,33.2 100.92,33.2 102.38,31.74 T21.C
E4
  Top 0.152: IC1.6 66.5,34.17 69.17,31.49 77.81,31.49 78.25,31.94 92.22,31.94 93.5,33.2 OK6.10
E5
  Top 0.152: IC1.7 67,34.17 69.36,31.81 77.68,31.81 78.13,32.25 90,32.25 90.95,33.2 OK6.12
E6
  Top 0.152: IC1.8 67.51,34.17 69.56,32.13 77.56,32.13 78,32.57 87.78,32.57 88.41,33.2 OK6.14
E7
  Top 0.152: IC1.9 67.99,34.2 69.75,32.44 77.43,32.44 77.88,32.89 85.56,32.89 85.88,33.2 OK6.16
F0
  Top 0.152: IC1.97 60.42,39.5 59.2,38.28 59.2,33.97 56.41,31.17 46.03,31.17 45.49,31.71 T25.C
F1
  Top 0.152: IC1.96 60.42,40.01 58.82,38.41 58.82,34.09 56.22,31.49 46.19,31.49 45.11,32.57 42.91,32.57 T26.C
F2
  Top 0.152: IC1.95 60.4,40.49 58.44,38.54 58.44,34.22 56.03,31.81 46.31,31.81 45.23,32.89 41.33,32.89 T27.C
F3
  Top 0.152: IC1.94 60.4,41 58.06,38.67 58.06,34.35 55.84,32.13 46.44,32.13 45.33,33.24 39.77,33.24 T28.C
F4
  Top 0.152: IC1.93 60.4,41.51 57.68,38.79 57.68,34.48 55.65,32.44 46.57,32.44 45.87,33.14 OK7.16
F5
  Top 0.152: IC1.92 60.37,41.99 57.3,38.92 57.3,34.6 55.46,32.76 48.86,32.76 48.41,33.2 OK7.14
F6
  Top 0.152: IC1.91 60.37,42.5 56.92,39.05 56.92,34.73 55.27,33.08 51.08,33.08 50.95,33.2 OK7.12
F7
  Top 0.152: IC1.90 60.37,43.01 56.54,39.17 56.54,37.65 56.54,37.52 56.54,36.95 OK7.10
GND  (via drill 0.35)
  Top 0.152: OK9.3 v34.44,43.37
  Top 0.305: 15.39,61.14 13.99,59.75 J2.SHELL
  other vias: 42.06,53.52 44.6,53.52 56.03,53.52 58.57,53.52 61.11,53.52 43.33,53.52 45.23,57.34 29.99,54.16 29.36,56.7 42.06,49.08 43.33,46.54 42.38,43.24 34.06,46.6 28.09,50.98 30.63,47.17 31.9,48.45 31.9,50.98 31.9,47.17 28.09,47.17 26.82,48.45 26.82,47.17 26.82,50.98 31.9,49.72 30.63,50.98 26.82,49.72 38.57,43.17 16.66,43.37 16.66,40.83 16.02,45.27 14.76,42.73 19.2,52.89 24.28,56.06 65.56,49.72 69.36,49.72 69.36,47.17 67.46,47.17 69.36,45.27 70,44.63 64.28,45.27 64.28,47.17 68.09,43.37 64.28,39.55 64.28,42.73 70,42.09 73.17,42.09 76.6,37.4 71.27,38.28 69.36,39.55 71.91,44.63 75.72,42.73 75.72,45.27 71.91,49.72 71.91,47.17 73.81,47.17 75.08,48.45 76.35,50.35 83.34,50.98 96.03,50.98 47.77,41.02 55.39,41.46 59.2,42.73 50.95,41.46 54.76,37.02 45.23,35.11 45.23,37.65 42.7,35.74 38.38,34.48 18.82,34.48 19.45,43.37 18.18,32.19 21.1,30.66 28.09,31.3 43.97,44.63 56.03,35.11 59.84,37.65 59.84,34.48 45.11,30.79 58.57,31.94 63.02,31.94 65.56,29.39 67.46,30.03 37.23,46.6 59.84,57.97 65.56,57.97 68.73,55.43 75.72,57.97 80.16,57.97 82.06,54.8 84.61,54.8 90.32,55.43 87.78,55.43 92.86,55.43 76.98,53.52 78.89,53.52 79.53,50.98 97.31,52.89 96.03,54.8 99.84,51.62 102.38,54.16 19.84,56.06 21.74,56.7 29.36,50.98 29.36,47.17 36.98,33.2 40.16,33.84 38.89,44.76 36.98,51.62 19.45,38.28 21.49,38.03 80.16,29.39 76.98,28.76 79.53,33.84 69.36,34.48 84.61,33.84 82.06,33.84 103.02,33.2 101.11,34.48 97.31,34.48 113.18,31.94 116.35,31.94 119.53,31.94 99.21,38.28 105.56,38.28 111.28,38.28 115.72,38.28 111.91,45.91 115.72,44 106.83,48.45 116.99,46.54 97.94,49.08 106.83,50.98 112.55,50.98 106.83,53.52 110.64,54.8 113.18,56.06 117.62,56.06 121.44,52.26 85.88,38.28 86.51,40.83 80.16,38.28 97.94,41.46 92.22,41.46 101.11,44.63 102.38,46.54
  pour Top (rank 3): -0.5,7.64 140.49,7.64 140.49,80.32 -0.5,80.32
  pour Bottom (rank 3): -0.5,7.64 140.49,7.64 140.49,80.32 -0.5,80.32
  cutout Top: 70,80 arc90 66,76 arc90 70,72 arc90 74,76 arc90
  cutout Bottom: 70,80 arc-90 74,76 arc-90 70,72 arc-90 66,76 arc-90
  cutout Bottom: 8,76 arc90 4,80 arc90 0,76 arc90 4,72 arc90
  cutout Bottom: 8,76 arc90 4,80 arc90 0,76 arc90 4,72 arc90
  cutout Top: 0,12 arc-90 4,16 arc-90 8,12 arc-90 4,8 arc-90
  cutout Bottom: 8,12 arc90 4,16 arc90 0,12 arc90 4,8 arc90
  cutout Top: 0,76 arc-90 4,80 arc-90 8,76 arc-90 4,72 arc-90
  cutout Bottom: 74,12 arc90 70,16 arc90 66,12 arc90 70,8 arc90
  cutout Top: 66,12 arc-90 70,16 arc-90 74,12 arc-90 70,8 arc-90
  cutout Top: 132,12 arc-90 136,16 arc-90 140,12 arc-90 136,8 arc-90
  cutout Bottom: 132,12 arc90 136,8 arc90 140,12 arc90 136,16 arc90
  cutout Bottom: 132,76 arc90 136,72 arc90 140,76 arc90 136,80 arc90
  cutout Top: 140,76 arc-90 136,72 arc-90 132,76 arc-90 136,80 arc-90
GND2  (via drill 0.35)
  Top 0.152: 24.66,40.83 IC4.28 24.66,38.02 C45.2 | 24.66,40.83 24.66,41.21 IC4.33 v26.19,42.73 | IC4.3 24.78,40.71 24.66,40.83
  Bottom 0.152: GND.TP 23.9,36.63 v23.9,35.74 23.9,35.24 13.23,24.57 12.34,24.57 11.58,23.81 11.58,22.41 9.34,20.18 X6.5 | v26.19,42.73 27.2,43.75 30.76,43.75 31.9,42.6 v31.9,42.09 31.9,41.71 v30.38,40.19 29.14,38.95 v29.14,38.92
  pour Top (rank 2): 22.57,35.3 28.09,35.3 28.79,34.6 37.55,34.6 38.76,35.81 38.76,39.24 36.85,41.14 36.85,42.79 38,43.94 36.92,45.02 24.91,45.02 22.57,42.67
H0
  Top 0.152: IC1.12 69.49,35.49 71.78,33.2 77.11,33.2 79.21,35.3 101.56,35.3 101.75,35.3 102.83,35.3 104.29,33.84 T20.C
H1
  Top 0.152: IC1.13 70,35.49 71.97,33.52 76.98,33.52 79.08,35.62 101.56,35.62 101.75,35.62 104.42,35.62 106.19,33.84 T19.C
H2
  Top 0.152: IC1.14 70.51,35.49 72.16,33.84 76.86,33.84 78.95,35.94 106,35.94 108.1,33.84 T18.C
H3
  Top 0.152: IC1.15 70.99,35.74 70.99,35.52 72.35,34.16 76.73,34.16 78.83,36.25 107.59,36.25 110,33.84 T17.C
H4
  Top 0.152: IC1.16 71.5,35.52 72.54,34.48 76.6,34.48 78.7,36.57 110.45,36.57 111.91,35.11 OK5.16
H5
  Top 0.152: IC1.17 72.01,35.52 72.73,34.79 76.48,34.79 78.57,36.89 112.67,36.89 114.45,35.11 OK5.14
H6
  Top 0.152: IC1.18 72.49,35.54 72.92,35.11 76.35,35.11 78.44,37.2 115.34,37.2 116.99,35.55 OK5.12
H7
  Top 0.152: IC1.27 78.69,38.49 79.65,37.52 117.12,37.52 119.53,35.11 OK5.10
INT  (via drill 0.35)
  Top 0.152: IC1.45 75.28,47.51 73.94,46.16 v72.79,46.16 | v57.17,47.43 53.36,47.43 52.86,47.94 IC3.12
  Bottom 0.152: v57.17,47.43 57.3,47.43 58.57,46.16 v72.79,46.16
J0
  Top 0.152: IC1.63 70,52.7 65.68,57.02 45.97,57.02 45.23,56.28 T8.C
J1
  Top 0.152: IC1.64 69.49,52.7 65.49,56.7 46.19,56.7 44.85,55.37 42.95,55.37 42.06,56.26 T7.C
J2
  Top 0.152: IC1.65 69.01,52.67 65.3,56.38 46.31,56.38 44.98,55.05 41.36,55.05 40.16,56.26 T6.C
J3
  Top 0.152: IC1.66 68.5,52.67 65.11,56.06 46.5,56.06 45.17,54.73 39.77,54.73 38.25,56.26 T5.C
J4
  Top 0.152: IC1.67 67.99,52.67 64.92,55.75 48.09,55.75 47.14,54.8 OK2.10
J5
  Top 0.152: IC1.68 67.51,52.65 64.73,55.43 50.31,55.43 49.68,54.8 OK2.12
J6
  Top 0.152: IC1.69 67,52.65 64.6,55.05 52.47,55.05 52.22,54.8 OK2.14
J7  (via drill 0.35)
  Top 0.152: IC1.79 63.57,48.5 v64.16,49.08 | OK2.16 54.76,54.35 54.89,54.48 v63.08,54.48
  Bottom 0.152: v64.16,49.08 64.16,53.4 v63.08,54.48
K0  (via drill 0.35)
  Top 0.152: IC1.89 59.08,43.49 58.19,42.6 48.73,42.6 v48.54,42.41 | v35.71,33.2 36.34,32.57 T29.C
  Bottom 0.152: v35.71,33.2 35.71,35.11 40.47,39.87 44.79,39.87 46.19,41.27 46.95,41.27 48.09,42.41 v48.54,42.41
K1  (via drill 0.35)
  Top 0.152: IC1.88 59.08,44 58.06,42.98 48.28,42.98 47.14,41.84 v46.7,41.84 | v33.8,33.2 34.44,32.57 T30.C
  Bottom 0.152: v33.8,33.2 34.88,33.2 35.39,33.71 35.39,35.24 35.65,35.49 35.65,35.55 40.28,40.19 44.66,40.19 46.31,41.84 v46.7,41.84
K2  (via drill 0.35)
  Top 0.152: IC1.87 59.08,44.51 57.94,43.37 47.84,43.37 v47.14,42.67 | v31.9,33.2 32.53,32.57 T31.C
  Bottom 0.152: v31.9,33.2 30.82,33.2 30.31,33.71 30.31,37.02 33.8,40.51 44.54,40.51 46.7,42.67 v47.14,42.67
K3  (via drill 0.35)
  Top 0.152: IC1.86 59.05,44.99 57.81,43.75 47.33,43.75 v47.14,43.55 | v29.99,33.2 30.63,32.57 T32.C
  Bottom 0.152: v29.99,33.2 29.99,37.14 33.68,40.83 44.41,40.83 v47.14,43.55
K4  (via drill 0.35)
  Top 0.152: IC1.85 59.05,45.5 57.68,44.13 46.89,44.13 45.49,42.73 v45.11,42.73 | OK8.10 27.45,33.2 26.82,32.57 v26.19,32.57
  Bottom 0.152: v26.19,32.57 26.19,33.78 33.55,41.14 43.08,41.14 44.66,42.73 v45.11,42.73
K5  (via drill 0.35)
  Top 0.152: IC1.84 59.05,46.01 57.55,44.51 46.82,44.51 45.87,43.55 v45.42,43.55 | OK8.12 24.91,32.57 v24.28,31.94
  Bottom 0.152: v24.28,31.94 24.28,32.32 33.42,41.46 42.95,41.46 45.04,43.55 v45.42,43.55
K6  (via drill 0.35)
  Top 0.152: IC1.83 59.03,46.49 57.43,44.89 46.38,44.89 v45.87,44.38 | OK8.14 22.38,32.63 v23.45,31.56 v23.45,31.55
  Bottom 0.152: v23.45,31.55 23.45,31.94 33.3,41.78 42.82,41.78 45.42,44.38 v45.87,44.38
K7  (via drill 0.35)
  Top 0.152: IC1.82 59.03,47 57.3,45.27 v45.87,45.27 | v22.25,31.81 21.23,31.81 19.84,33.2 OK8.16
  Bottom 0.152: v22.25,31.81 22.88,31.81 33.17,42.09 42.7,42.09 v45.87,45.27
L0
  Top 0.152: IC1.35 78.66,42.5 79.02,42.86 97.18,42.86 106.26,51.94 119.21,51.94 120.8,53.52 OK4.16
L1
  Top 0.152: IC1.36 78.66,43.01 78.89,43.24 97.05,43.24 104.23,50.41 104.42,50.6 106.07,52.26 116.99,52.26 118.26,53.52 OK4.14
L2
  Top 0.152: IC1.37 78.64,43.49 78.76,43.62 96.92,43.62 105.88,52.57 114.77,52.57 115.72,53.52 OK4.12
L3
  Top 0.152: IC1.38 96.8,44 102.77,49.97 103.02,50.22 105.69,52.89 112.55,52.89 113.18,53.52 OK4.10
L4
  Top 0.152: IC1.39 78.64,44.51 78.76,44.38 96.67,44.38 107.72,55.43 109.15,55.43 T16.C
L5
  Top 0.152: IC1.40 78.66,44.99 78.89,44.76 96.54,44.76 105.43,53.65 105.54,53.76 108.07,56.28 T15.C
L6
  Top 0.152: IC1.41 78.66,45.5 79.02,45.14 96.42,45.14 104.23,52.95 104.27,53 106.19,54.92 T14.C
L7
  Top 0.152: IC1.42 78.66,46.01 79.14,45.52 96.29,45.52 104.29,53.52 T13.C
MISO  (via drill 0.35)
  Top 0.152: v49.05,47.17 IC3.15 | v74.57,38.16 74.57,38.03 74.5,37.95 IC1.22
  Bottom 0.152: v49.05,47.17 50.06,46.16 52.98,46.16 63.14,36 72.79,36 | v74.57,38.16 74.57,37.78 72.79,36 | ISP.1 72.79,29.01 72.79,36
MISO2  (via drill 0.35)
  Top 0.152: IC4.17 22.16,43.21 21.68,42.73 v21.68,42.35
  Bottom 0.152: v21.68,42.35 21.68,41.52 MISO.TP
MOSI  (via drill 0.35)
  Top 0.152: v50.31,47.17 IC3.14 | v73.68,38.28 73.99,37.98 IC1.21
  Bottom 0.152: v50.31,47.17 50.95,46.54 53.11,46.54 63.27,36.38 72.54,36.38 73.68,37.52 v73.68,38.28 74.19,38.79 74.83,38.79 75.21,38.41 75.21,37.9 73.17,35.87 73.17,29.52 73.56,29.14 73.56,25.71 73.05,25.2 71.02,25.2 ISP.4
MOSI2  (via drill 0.35)
  Top 0.152: IC4.16 23.16,44.35 v23.01,44.51
  Bottom 0.152: v23.01,44.51 22.69,44.51 21.1,42.92 21.1,39.55 21.74,38.92 MOSI.TP
N$1
  Top 1.016: B1.+ B1.-
N$2
  Top 0.152: B1.AC1 17.93,69.4 17.17,68.64 17.17,63.31 R9.2
  Top 1.016: B1.AC1 17.93,71.11 19.39,72.58 22.12,72.58 24.75,75.2 X1.2
N$3
  Top 1.016: B5.+ B5.-
N$4
  Top 0.152: R9.1 C11.1 19.84,63.03 19.84,62.41 21.1,61.14 OK1.7
N$5
  Top 1.016: B2.+ B2.-
N$6
  Top 0.152: R10.2 22.25,63.31 22.25,68.64 23.01,69.4 B2.AC1
  Top 1.016: B2.AC1 23.01,71.13 24.45,72.58 26.19,72.58 28.25,74.64 X1.3
N$7
  Top 1.016: B3.+ B3.-
N$8
  Top 0.152: C12.1 R10.1 23.51,61.34 23.65,61.21 OK1.5
N$9
  Top 0.152: B24.AC1 86.51,18.6 87.27,19.36 87.27,24.69 R32.2
  Top 1.016: B24.AC1 86.51,16.7 90.75,12.45 X3.9
N$10
  Top 0.152: R45.1 36.15,44.26 35.77,44.63 OK9.4 34.44,44.63 33.47,43.67 C46.1
N$11
  Top 0.152: C13.1 R11.1 28.59,62.28 28.09,61.78 26.76,61.78 26.19,61.21 OK1.3
N$12
  Top 1.016: B4.+ B4.-
N$13
  Top 0.152: B4.AC1 33.17,69.4 32.41,68.64 32.41,63.31 R12.2
  Top 1.016: B4.AC1 33.17,72.58 35.25,74.66 X1.5
N$14
  Top 0.152: C14.1 R12.1 33.67,62.98 33.04,62.35 29.3,62.35 28.73,61.78 OK1.1
N$15
  Top 0.152: B5.AC1 38.25,69.4 37.49,68.64 37.49,63.31 R13.2
  Top 1.016: B5.AC1 38.25,72.58 38.75,73.08 X1.6
N$16
  Top 0.152: R13.1 C15.1 40.14,62.92 41.28,61.78 46.5,61.78 47.14,61.14 OK2.7
N$17
  Top 0.152: IC1.47 S1.8
N$18
  Top 0.152: IC1.48 86.43,49 87.27,49.84 90.07,49.84 90.95,48.95 S1.7
N$19
  Top 0.152: IC1.49 86.43,49.51 87.14,50.22 92.22,50.22 93.5,48.95 S1.6
N$20
  Top 0.152: IC1.50 86.41,49.99 87.02,50.6 94.38,50.6 96.03,48.95 S1.5
N$21
  Bottom 0.152: J1.1 15.52,41.97 15.52,43.62 17.93,46.03 17.93,53.27 17.17,54.03 16.28,54.03 14.12,56.19 J2.1
N$22
  Top 1.016: B6.+ B6.-
N$23
  Top 0.152: B6.AC1 43.33,69.4 42.57,68.64 42.57,63.31 R14.2
  Top 1.016: B6.AC1 43.33,71.05 42.25,72.13 X1.7
N$24
  Top 0.152: R14.1 C16.1 45.22,62.94 46.06,62.1 48.73,62.1 49.68,61.14 OK2.5
N$25
  Top 1.016: B7.+ B7.-
N$26
  Top 0.152: B7.AC1 48.41,69.4 47.65,68.64 47.65,63.31 R15.2
  Top 1.016: B7.AC1 48.41,71.05 45.75,73.71 X1.8
N$27
  Top 0.152: R46.1 27.95,44.39 28.98,43.37 OK9.2
N$28
  Top 0.152: R15.1 C17.1 50.3,62.86 52.22,60.94 OK2.3
N$29
  Top 1.016: B8.+ B8.-
N$30
  Top 0.152: B8.AC1 53.49,69.4 52.73,68.64 52.73,63.31 R16.2
  Top 1.016: B8.AC1 53.49,71.05 49.25,75.29 X1.9
N$31
  Top 0.152: R16.1 C18.1 55.39,63.03 55.39,62.41 54.76,61.78 OK2.1
N$32
  Top 0.152: RN1.1 31.88,59.63 T1.A
N$33
  Top 0.152: RN1.2 33.09,59 32.51,58.41 T2.A
N$34
  Top 0.152: T3.A 33.89,58.94 RN1.3
N$35
  Top 0.152: T4.A 35.1,59.63 RN1.4
N$36
  Top 0.152: RN2.1 39.5,59.63 T5.A
N$37
  Top 0.152: RN2.2 40.58,59.5 40.58,58.81 T6.A
N$38
  Top 0.152: RN2.3 41.63,59.5 41.63,58.81 T7.A
N$39
  Bottom 0.152: J1.2 15.9,40.06 15.9,43.49 18.31,45.91 18.31,53.4 J2.2
N$40
  Top 0.152: RN2.4 42.72,59.63 T8.A
N$41
  Top 1.016: B9.+ B9.-
N$42
  Top 0.152: B9.AC1 83.97,69.4 83.21,68.64 83.21,63.31 R17.2
  Top 1.016: B9.AC1 83.97,71.94 84.61,72.58 88.22,72.58 90.75,75.1 X2.2
N$43
  Top 0.152: R17.1 C19.1 85.88,63.03 85.88,62.41 87.14,61.14 OK3.7
N$44
  Top 1.016: B10.+ B10.-
N$45
  Top 0.152: B10.AC1 89.05,69.4 88.29,68.64 88.29,63.31 R18.2
  Top 1.016: B10.AC1 89.05,70.99 90.64,72.58 92.22,72.58 94.25,74.6 X2.3
N$46
  Top 0.152: C20.1 R18.1 89.69,62.91 OK3.5
N$47
  Top 1.016: B11.+ B11.-
N$48
  Top 0.152: B11.AC1 94.13,69.4 93.37,68.64 93.37,63.31 R19.2
  Top 1.016: B11.AC1 94.13,71.31 97.75,74.92 X2.4
N$49
  Top 0.152: USBTX.C 11.07,18.51 R48.1
N$50
  Top 0.152: C21.1 R19.1 94.63,62.41 94,61.78 92.86,61.78 92.22,61.14 OK3.3
N$51
  Top 1.016: B12.+ B12.-
N$52
  Top 0.152: B12.AC1 99.21,69.4 98.45,68.64 98.45,63.31 R20.2
  Top 1.016: B12.AC1 99.21,71.94 101.25,73.98 X2.5
N$53
  Top 0.152: C22.1 R20.1 99.71,62.41 99.08,61.78 95.4,61.78 94.77,61.14 OK3.1
N$54
  Top 1.016: B13.+ B13.-
N$55
  Top 0.152: B13.AC1 104.29,69.4 103.53,68.64 103.53,63.31 R21.2
  Top 1.016: B13.AC1 104.29,71.31 104.75,71.77 X2.6
N$56
  Top 0.152: R21.1 C23.1 106.19,63.03 106.19,62.41 106.83,61.78 112.55,61.78 113.18,61.14 OK4.7
N$57
  Top 1.016: B14.+ B14.-
N$58
  Top 0.152: B14.AC1 109.37,69.4 108.61,68.64 108.61,63.31 R22.2
  Top 1.016: B14.AC1 109.37,71.31 108.25,72.42 X2.7
N$59
  Top 0.152: R22.1 C24.1 111.28,63.03 111.28,62.54 111.66,62.16 114.7,62.16 115.72,61.14 OK4.5
N$60
  Top 1.016: B15.+ B15.-
N$61
  Top 0.152: B15.AC1 114.45,69.4 113.69,68.64 113.69,63.31 R23.2
  Top 1.016: B15.AC1 114.45,71.31 111.75,74 X2.8
N$62
  Top 0.152: USBRX.C R47.1
N$63
  Top 0.152: R23.1 C25.1 116.35,63.03 116.35,62.41 116.99,61.78 117.62,61.78 118.26,61.14 OK4.3
N$64
  Top 1.016: B16.+ B16.-
N$65
  Top 0.152: B16.AC1 119.53,69.4 118.77,68.64 118.77,63.31 R24.2
  Top 1.016: B16.AC1 119.53,71.31 115.25,75.59 X2.9
N$66
  Top 0.152: R24.1 C26.1 121.44,63.03 121.44,62.41 120.8,61.78 OK4.1
N$67
  Top 1.016: B17.- B17.+
N$68
  Top 0.152: B17.AC1 122.07,18.6 122.83,19.36 122.83,24.69 R25.2
  Top 1.016: B17.AC1 122.07,16.7 120.8,15.43 118.26,15.43 115.25,12.41 X3.2
N$69
  Top 0.152: C27.1 120.18,25.57 119.53,26.22 OK5.7
  Top 0.254: C27.1 R25.1
N$70
  Top 1.016: B18.- B18.+
N$71
  Top 0.152: B18.AC1 116.99,18.6 117.75,19.36 117.75,24.69 R26.2
  Top 1.016: B18.AC1 116.99,16.7 115.72,15.43 114.07,15.43 111.75,13.11 X3.3
N$72
  Top 0.152: R26.1 116.49,25.72 116.99,26.22 OK5.5
  Top 0.254: C28.1 R26.1
N$73
  Top 1.016: B19.- B19.+
N$74
  Top 0.152: B19.AC1 111.91,18.6 112.67,19.36 112.67,24.69 R27.2
  Top 1.016: B19.AC1 111.91,16.7 108.25,13.04 X3.4
N$76
  Top 0.152: R27.1 111.41,25.59 112.04,26.22 113.81,26.22 114.45,26.86 OK5.3
  Top 0.254: C29.1 R27.1
N$77
  Top 1.016: B20.- B20.+
N$78
  Top 0.152: B20.AC1 106.83,18.6 107.59,19.36 107.59,24.69 R28.2
  Top 1.016: B20.AC1 106.83,16.7 104.75,14.61 X3.5
N$79
  Top 0.152: R28.1 106.33,25.59 106.96,26.22 111.28,26.22 111.91,26.86 OK5.1
  Top 0.254: C30.1 R28.1
N$80
  Top 1.016: B21.- B21.+
N$82
  Top 0.152: C31.1 99.84,24.96 99.84,25.59 99.21,26.22 94.13,26.22 93.5,26.86 OK6.7
  Top 0.254: C31.1 R29.1
N$83
  Top 1.016: B22.- B22.+
N$84
  Top 0.152: R40.2 21.23,24.69 21.23,19.36 20.47,18.6 B32.AC1
  Top 1.016: B32.AC1 20.47,16.7 24.75,12.41 X4.9
N$85
  Top 0.152: C32.1 94.77,24.96 94.77,25.08 93.62,26.22 91.59,26.22 90.95,26.86 OK6.5
  Top 0.254: C32.1 R30.1
N$86
  Top 1.016: B23.- B23.+
N$87
  Top 0.152: B23.AC1 91.59,18.6 92.35,19.36 92.35,24.69 R31.2
  Top 1.016: B23.AC1 91.59,16.7 94.25,14.04 X3.8
N$89
  Top 0.152: C33.1 89.7,25.06 88.41,26.35 OK6.3
  Top 0.254: C33.1 R31.1
N$90
  Top 1.016: B24.- B24.+
N$91
  Top 0.152: B31.AC1 25.55,18.6 26.31,19.36 26.31,24.69 R39.2
  Top 1.016: B31.AC1 25.55,16.7 28.25,14 X4.8
N$92
  Top 0.152: R32.1 85.88,25.09 OK6.1
  Top 0.254: C34.1 R32.1
N$93
  Top 1.016: B25.- B25.+
N$94
  Top 0.152: B25.AC1 56.03,18.6 56.79,19.36 56.79,24.69 R33.2
  Top 1.016: X4.2 49.25,13.09 51.59,15.43 54.76,15.43 56.03,16.7 B25.AC1
N$95
  Top 0.152: OK7.7 53.49,26.86 54.14,26.2 C35.1
  Top 0.254: C35.1 R33.1
N$96
  Top 1.016: B26.- B26.+
N$97
  Top 0.152: B26.AC1 50.95,18.6 51.71,19.36 51.71,24.69 R34.2
  Top 1.016: X4.3 45.75,14.04 47.14,15.43 49.68,15.43 50.95,16.7 B26.AC1
N$98
  Top 0.152: R34.1 50.45,25.71 50.95,26.21 OK7.5
  Top 0.254: C36.1 R34.1
N$99
  Top 1.016: B27.- B27.+
N$100
  Top 0.152: B27.AC1 45.87,18.6 46.63,19.36 46.63,24.69 R35.2
  Top 1.016: B27.AC1 45.87,16.7 42.25,13.07 X4.4
N$101
  Top 0.152: B3.AC1 28.09,69.4 27.33,68.64 27.33,63.31 R11.2
  Top 1.016: X1.4 31.75,74.79 28.09,71.13 B3.AC1
N$102
  Top 0.152: OK7.3 48.41,26.86 47.77,26.22 46.63,26.22 R35.1
  Top 0.254: C37.1 R35.1
N$103
  Top 1.016: B28.- B28.+
N$104
  Top 0.152: B28.AC1 40.79,18.6 41.55,19.36 41.55,24.69 R36.2
  Top 1.016: B28.AC1 40.79,16.7 38.75,14.66 X4.5
N$105
  Top 0.152: OK7.1 45.87,27.11 44.98,26.22 41.55,26.22 R36.1
  Top 0.254: C38.1 R36.1
N$106
  Top 1.016: B29.- B29.+
N$108
  Top 0.152: OK8.7 27.45,26.86 28.09,26.22 32.6,26.22 33.82,25 C39.1
  Top 0.254: R37.1 C39.1
N$109
  Top 1.016: B30.- B30.+
N$111
  Top 0.152: OK8.5 24.91,26.86 25.55,26.22 27.6,26.22 28.74,25.08 C40.1
  Top 0.254: R38.1 C40.1
N$112
  Top 1.016: B31.- B31.+
N$114
  Top 0.152: B30.AC1 30.63,18.6 31.39,19.36 31.39,24.69 R38.2
  Top 1.016: X4.7 31.75,14.94 30.63,16.06 B30.AC1
N$115
  Top 0.152: OK8.3 22.38,26.86 23.66,25.57 C41.1
  Top 0.254: R39.1 C41.1
N$116
  Top 1.016: B32.- B32.+
N$118
  Top 0.152: OK8.1 19.84,25.09 R40.1
  Top 0.254: C42.1 R40.1
N$119
  Top 0.152: RN3.1 97.06,59.63 96.67,59.24 T9.A
N$120
  Top 0.152: RN3.2 99.13,58.94 T10.A
N$121
  Top 0.152: RN3.3 99.93,58.94 T11.A
N$122
  Top 0.152: RN3.4 101.99,59.63 102.38,59.24 T12.A
N$123
  Top 0.152: RN4.1 104.68,59.63 104.29,59.24 T13.A
N$124
  Top 0.152: RN4.2 106.75,58.94 T14.A
N$125
  Top 0.152: RN4.3 107.55,58.94 T15.A
N$126
  Top 0.152: RN4.4 109.61,59.63 110,59.24 T16.A
N$127
  Top 0.152: B22.AC1 96.67,18.6 97.43,19.36 97.43,24.69 R30.2
  Top 1.016: B22.AC1 96.67,16.7 97.75,15.61 X3.7
N$128
  Top 0.152: C45.1 24.16,38.82 IC4.27
N$129
  Top 0.152: R42.2 9.98,22.57 X6.2
N$130
  Top 0.152: R43.2 X6.3
N$131
  Top 0.152: RN5.1 109.61,28.37 110,28.76 T17.A
N$133
  Top 0.152: R4.1 POWER.C
N$134
  Top 0.152: R3.2 35.84,50.22 TERM.1
N$136
  Top 0.152: RN5.2 107.55,29.06 T18.A
N$137
  Top 0.152: R5.1 STATUS.C
N$138
  Top 0.152: RN5.3 106.75,29.06 T19.A
N$139
  Top 0.152: RN5.4 104.68,28.37 104.29,28.76 T20.A
N$140
  Top 0.152: RN6.1 101.99,28.37 102.38,28.76 T21.A
N$141
  Top 0.152: RN6.2 99.93,29.06 T22.A
N$142
  Top 0.152: RN6.3 99.13,29.06 T23.A
N$143
  Top 0.152: T24.A 96.67,28.76 97.06,28.37 RN6.4
N$144
  Top 0.152: T25.A 43.97,28.76 43.57,28.37 RN7.1
N$145
  Top 0.152: RN7.2 41.51,29.06 T26.A
N$146
  Top 0.152: RN7.3 40.71,29.06 T27.A
N$147
  Top 0.152: T28.A 38.25,28.76 38.64,28.37 RN7.4
N$148
  Top 0.152: T29.A 36.34,28.76 35.95,28.37 RN8.1
N$149
  Top 0.152: RN8.2 33.89,29.06 T30.A
N$150
  Top 0.152: T31.A 33.09,29.06 RN8.3
N$151
  Top 0.152: T32.A 30.63,28.98 31.24,28.37 RN8.4
N$152
  Top 0.152: B21.AC1 101.75,18.6 102.51,19.36 102.51,24.69 R29.2
  Top 1.016: B21.AC1 101.75,16.7 101.25,16.2 X3.6
N$153
  Top 0.152: B29.AC1 35.71,18.6 36.47,19.36 36.47,24.69 R37.2
  Top 1.016: X4.6 35.25,15.18 35.71,15.64 B29.AC1
OSC1
  Top 0.152: C7.1 47.64,35.98 Q2.1 48.8,36.63 52.35,36.63 52.85,36.13 R2.1 54.12,37.4 IC3.8
OSC2
  Top 0.152: Q2.3 50.45,37.28 C8.1 51.73,37.13 R2.2 IC3.7
OSC3
  Top 0.152: C43.1 29.23,36.24 Q3.1 30.44,36.95 30.44,39.3 29.92,39.82 R41.1 28.85,39.71 IC4.1
OSC4
  Top 0.152: C44.1 32.03,37.54 Q3.3 31.78,39.81 30.77,40.82 R41.2 28.24,40.21 IC4.2
RESET  (via drill 0.35)
  Top 0.152: v75.97,39.05 75.97,39.3 76.68,40.01 IC1.30 | v46.5,47.17 IC3.17 | v74.57,29.14 73.17,27.74 68.48,27.74 ISP.5 63.52,32.7 v63.52,35.24 R8.1 | v84.86,41.84 85.11,42.09 97.43,42.09 101.09,45.75 U$15.P$3 U$15.P$4 | v36.73,43.37 36.73,42.98 35.77,42.03 C46.2
  Bottom 0.152: v74.57,29.14 73.94,29.78 73.94,35.62 75.97,37.65 v75.97,39.05 78,41.08 84.1,41.08 v84.86,41.84 | v63.52,35.24 63.39,35.24 52.86,45.78 47.9,45.78 v46.5,47.17 45.23,47.17 42.06,44 37.36,44 v36.73,43.37
RESET2  (via drill 0.35)
  Top 0.152: R44.2 22.89,36.7 22.55,37.04 22.55,39.65 IC4.24 21.84,39.71 v21.68,39.87
  Bottom 0.152: v21.68,39.87 23.33,39.87 RS.TP
RXCAN
  Top 0.152: IC2.4 42.06,40.89 42.76,40.19 43.97,40.19 44.6,40.83 45.74,40.83 46.5,40.06 IC3.2
RXD  (via drill 0.35)
  Top 0.152: IC1.2 64.49,34.32 64.22,34.05 v64.22,33.27 | IC5.2 v43.33,37.02
  Bottom 0.152: v43.33,37.02 44.16,37.02 47.65,33.52 63.97,33.52 v64.22,33.27
RXDUSB
  Top 0.152: IC4.8 27.6,43.21 28.46,42.35 29.68,42.35 33.74,38.28 IC5.6
RXLED  (via drill 0.35)
  Top 0.152: R47.2 13.87,22.03 13.87,26.6 v13.61,26.86 | v26.06,44.63 26.16,44.53 IC4.10
  Bottom 0.152: v26.06,44.63 24.99,45.7 22.3,45.7 20.09,43.49 20.09,32.95 13.99,26.86 v13.61,26.86
SCK  (via drill 0.35)
  Top 0.152: v51.59,47.17 IC3.13 | v72.79,38.28 72.79,38.16 73.5,37.45 IC1.20
  Bottom 0.152: v51.59,47.17 52.98,47.17 63.4,36.76 72.41,36.76 72.79,37.14 v72.79,38.28 73.68,39.17 74.95,39.17 75.59,38.54 75.59,37.78 73.56,35.74 73.56,29.65 73.94,29.27 73.94,25.59 73.17,24.82 69.87,24.82 68.98,25.71 68.98,27.74 ISP.3
SCK2  (via drill 0.35)
  Top 0.152: IC4.15 23.66,44.37 v23.87,44.57
  Bottom 0.152: SCK.TP 21.61,37.02 20.79,37.84 20.79,43.14 22.73,45.08 23.36,45.08 v23.87,44.57
SCL  (via drill 0.35)
  Top 0.152: IC1.43 76.05,46.49 75.84,46.29 v74.95,46.29 | R6.1 71.27,59.24 70,60.51 I²C.2
  Bottom 0.152: v74.95,46.29 74.95,47.05 74.06,47.94 74.06,56.45 70,60.51 I²C.2
SDA  (via drill 0.35)
  Top 0.152: IC1.44 75.66,47 v75.59,46.92 | R7.1 I²C.1
  Bottom 0.152: v75.59,46.92 74.44,48.06 74.44,56.57 72.54,58.48 I²C.1
STATUS  (via drill 0.35)
  Top 0.152: IC1.46 79.35,47.99 81.43,45.91 96.16,45.91 97.31,47.05 v97.31,47.43 | STATUS.A 119.05,42.95 114.46,47.54 104.27,47.54 v104.02,47.79
  Bottom 0.152: v104.02,47.79 97.67,47.79 v97.31,47.43
TXCAN
  Top 0.152: IC2.1 38.25,40.94 38.82,40.37 42.14,40.37 42.63,39.87 44.09,39.87 44.73,40.51 44.79,40.51 45.23,40.06 IC3.1
TXD  (via drill 0.35)
  Top 0.152: v64.92,33.84 65,33.92 IC1.3 | IC5.3 v43.33,38.28
  Bottom 0.152: v43.33,38.28 47.77,33.84 v64.92,33.84
TXDUSB
  Top 0.152: IC4.9 27.55,43.76 28.57,42.74 29.73,42.74 33.55,38.92 36.85,38.92 37.23,38.54 37.23,37.27 36.98,37.02 IC5.7
TXLED  (via drill 0.35)
  Top 0.152: R48.2 11.72,21.01 12.29,21.01 13.23,21.95 v13.23,25.97 | v25.17,44.63 25.66,44.14 IC4.11
  Bottom 0.152: v13.23,25.97 13.36,26.09 13.74,26.09 20.47,32.82 20.47,43.37 22.5,45.4 24.53,45.4 25.17,44.76 v25.17,44.63
VCC  (via drill 0.35)
  Top 0.152: C1.1 62.23,36.39 R8.2 IC1.100 | v83.34,42.22 83.59,42.48 97.31,42.48 101.99,47.16 | R7.2 R6.2 70.15,55.56 C2.1 | POWER.A 118.05,41 118,41 118,43.5 114.34,47.16 101.99,47.16 | RN1.8 RN1.7 RN1.6 RN1.5 37.23,60.88 | 37.23,60.88 RN2.8 RN2.7 RN2.6 RN2.5 | v37.23,59.49 37.23,60.88 | RN3.8 RN3.7 RN3.6 RN3.5 103.27,60.88 | 103.27,60.88 RN4.8 RN4.7 RN4.6 RN4.5 | 101.99,47.16 104.04,49.21 v104.35,49.21 | v103.27,59.49 103.27,60.88 | 38.25,44 36.98,42.73 36.98,41.21 38.89,39.3 38.89,36.89 40.03,35.74 IC5.1 37.3,32.33 37.3,27.12 | RN8.5 RN8.6 RN8.7 RN8.8 37.3,27.12 | 37.3,27.12 RN7.5 RN7.6 RN7.7 RN7.8 | RN5.8 RN5.7 RN5.6 RN5.5 RN6.8 RN6.7 RN6.6 RN6.5 97.55,27.12 94.32,30.35 79.84,30.35 75.72,26.22 ISP.2 | R45.2 36.98,45.27
  Top 0.305: IC1.100 64.01,38.01 66.51,40.51 | 66.51,40.51 69.36,43.37 | 69.36,43.37 64.74,47.99 IC1.80 59.38,47.99 57.3,45.91 45.23,45.91 IC3.18 45.23,49.08 45.22,49.09 C3.1 | IC1.31 76.05,40.49 v75.08,41.46 73.17,43.37 71.02,43.37 | 69.36,43.37 71.02,43.37 | 71.02,43.37 70.99,43.39 IC1.61 70.99,53.17 70,54.16 C2.1 | 66.51,40.51 68.5,38.51 IC1.10 68.5,34.32 69.75,33.08 v70,33.08 | IC2.3 40.79,43.94 | 42.7,44.63 42.06,45.27 IC2.5 42.06,47.8 40.79,49.06 v40.16,49.06 C6.1
  Top 0.406: 42.7,44.63 42,43.94 40.79,43.94 38.31,43.94 38.25,44 36.98,45.27 29.11,45.27 28.59,45.78 24.43,45.78 23.42,46.8 IC8.2 | 42.7,44.63 43.97,45.91 45.23,45.91 | 42.7,44.63 43.52,43.81 C10.1
  Bottom 0.152: v75.08,41.46 82.57,41.46 v83.34,42.22 | v37.23,59.49 37.23,52.26 40.16,49.33 v40.16,49.06 | v104.35,49.21 104.35,52.83 103.27,53.91 v103.27,59.49
  Bottom 0.305: v70,33.08 71.27,31.81 71.27,27.49 ISP.2
VCC2  (via drill 0.35)
  Top 0.152: v28.28,39.05 28.17,39.16 IC4.32 | IC4.31 IC4.32 | v27.96,41.21 IC4.4 | R44.1 25.22,36.7 26.66,38.14 IC4.32 | IC5.8 36.98,35.74 37.93,36.7 37.93,39.24 37.04,40.13 34.11,40.13 33.47,40.76 C47.1 32.97,40.89 32.71,41.14 32.71,42.24 32.28,42.67 31.01,42.67 v30.5,43.17 30.5,44.13 29.99,44.63 OK9.1 | USBRX.A USBTX.A 10.31,15.68 6.63,19.36 6.63,22.92 7.13,23.43 8.64,23.43 X6.1
  Bottom 0.152: v28.28,39.05 27.96,39.36 | 27.96,39.36 v27.96,41.21 27.96,41.97 29.17,43.17 v30.5,43.17 | 27.96,39.36 27.52,38.92 VCC.TP 23.26,37.9 23.26,35.11 13.29,25.14 13.1,24.95 12.22,24.95 10.64,23.38 X6.1
XTAL1
  Top 0.152: IC1.34 82.57,41.99 83.28,41.28 | 83.28,41.28 83.47,41.09 82.45,40.06 82.45,38.21 R1.1 | C4.1 83.85,40.84 Q1.1 83.34,41.34 83.28,41.28
XTAL2
  Top 0.152: R1.2 81.5,38.98 81.25,39.24 Q1.3 81.3,39.93 81.3,39.94 81.05,40.19 80.16,40.19 79.91,40.44 C5.1 79.78,40.84 79.11,41.51 IC1.33

## Text on the board
Top: MäCAN Dx32 V1.1 - © 2020 github.com/Ixam97
tPlace: DCC> | <DCC | DCC> | <DCC | GND | SCL | SDA | DCC> | <DCC | DCC> | <DCC
tNames: Low | High | GND | V+ | Dx32 V1.1 | UID: | GND | Reset | V+ | GND | JLCJLCJLCJLC